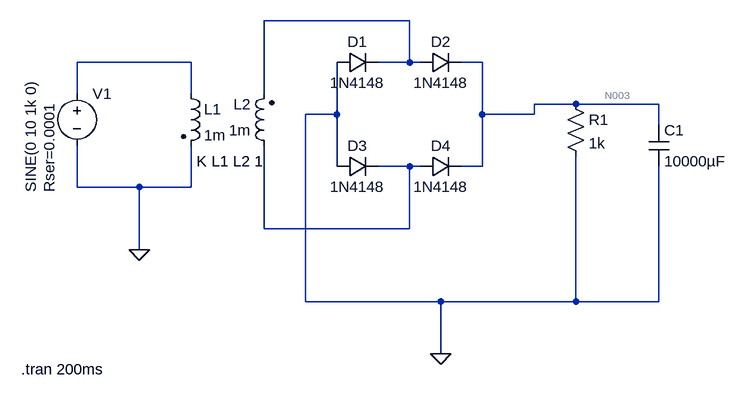
[diagram p0: schematic Draft2.asc]
Draft2.asc, the LTspice schematic file:
Version 4
SHEET 1 880 680
WIRE 256 -80 32 -80
WIRE -80 -16 -256 -16
WIRE 256 -16 256 -80
WIRE 256 -16 208 -16
WIRE 272 -16 256 -16
WIRE 368 -16 336 -16
WIRE -256 32 -256 -16
WIRE -80 32 -80 -16
WIRE 32 32 32 -80
WIRE 512 48 448 48
WIRE 640 48 512 48
WIRE 144 64 144 -16
WIRE 144 64 96 64
WIRE 368 64 368 -16
WIRE 448 64 448 48
WIRE 448 64 368 64
WIRE 640 80 640 48
WIRE 144 144 144 64
WIRE 256 144 208 144
WIRE 272 144 256 144
WIRE 368 144 368 64
WIRE 368 144 336 144
WIRE -256 176 -256 112
WIRE -160 176 -256 176
WIRE -80 176 -80 112
WIRE -80 176 -160 176
WIRE 32 240 32 112
WIRE 256 240 256 144
WIRE 256 240 32 240
WIRE -160 272 -160 176
WIRE 96 352 96 64
WIRE 304 352 96 352
WIRE 512 352 512 128
WIRE 512 352 304 352
WIRE 640 352 640 144
WIRE 640 352 512 352
WIRE 304 432 304 352
FLAG 304 432 0
FLAG -160 272 0
SYMBOL res 496 32 R0
SYMATTR InstName R1
SYMATTR Value 1k
SYMBOL voltage -256 16 R0
WINDOW 3 -71 168 VLeft 2
WINDOW 123 0 0 Left 0
WINDOW 39 -43 168 VLeft 2
SYMATTR InstName V1
SYMATTR Value SINE(0 10 1k 0)
SYMATTR SpiceLine Rser=0.0001
SYMBOL ind2 -96 16 R0
SYMATTR InstName L1
SYMATTR Value 1m
SYMATTR Type ind
SYMBOL ind2 48 128 R180
WINDOW 0 36 80 Left 2
WINDOW 3 36 40 Left 2
SYMATTR InstName L2
SYMATTR Value 1m
SYMATTR Type ind
SYMBOL cap 624 80 R0
SYMATTR InstName C1
SYMATTR Value 10000µF
SYMBOL diode 144 0 R270
WINDOW 0 32 32 VTop 2
WINDOW 3 0 32 VBottom 2
SYMATTR InstName D1
SYMATTR Value 1N4148
SYMBOL diode 272 0 R270
WINDOW 0 32 32 VTop 2
WINDOW 3 0 32 VBottom 2
SYMATTR InstName D2
SYMATTR Value 1N4148
SYMBOL diode 144 160 R270
WINDOW 0 32 32 VTop 2
WINDOW 3 0 32 VBottom 2
SYMATTR InstName D3
SYMATTR Value 1N4148
SYMBOL diode 272 160 R270
WINDOW 0 32 32 VTop 2
WINDOW 3 0 32 VBottom 2
SYMATTR InstName D4
SYMATTR Value 1N4148
TEXT -342 456 Left 2 !.tran 200ms
TEXT -72 136 Left 2 !K L1 L2 1

The netlist it stands for:
* Draft2.asc
R1 N003 0 1k
V1 N002 0 SINE(0 10 1k 0) Rser=0.0001
L1 N002 0 1m
L2 N004 N001 1m
C1 N003 0 10000µF
D1 0 N001 1N4148
D2 N001 N003 1N4148
D3 0 N004 1N4148
D4 N004 N003 1N4148
.model D D
.lib standard.dio
.tran 200ms
K L1 L2 1
.backanno
.end

* Results of the author's LTspice run, read from the files saved beside the schematic
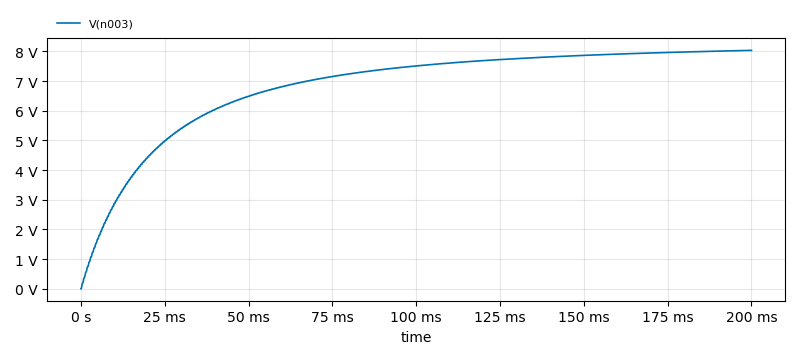
[diagram p1: Transient Analysis of Draft2.asc, plotted from the saved traces]
* Transient Analysis, 1 run:
*   V(n003): min 0 V, max 8.037 V, average 6.811 V, rms 7.007 V, last 8.037 V